# EAGLE design NixieClock Modified2  (EAGLE 7.5.0)
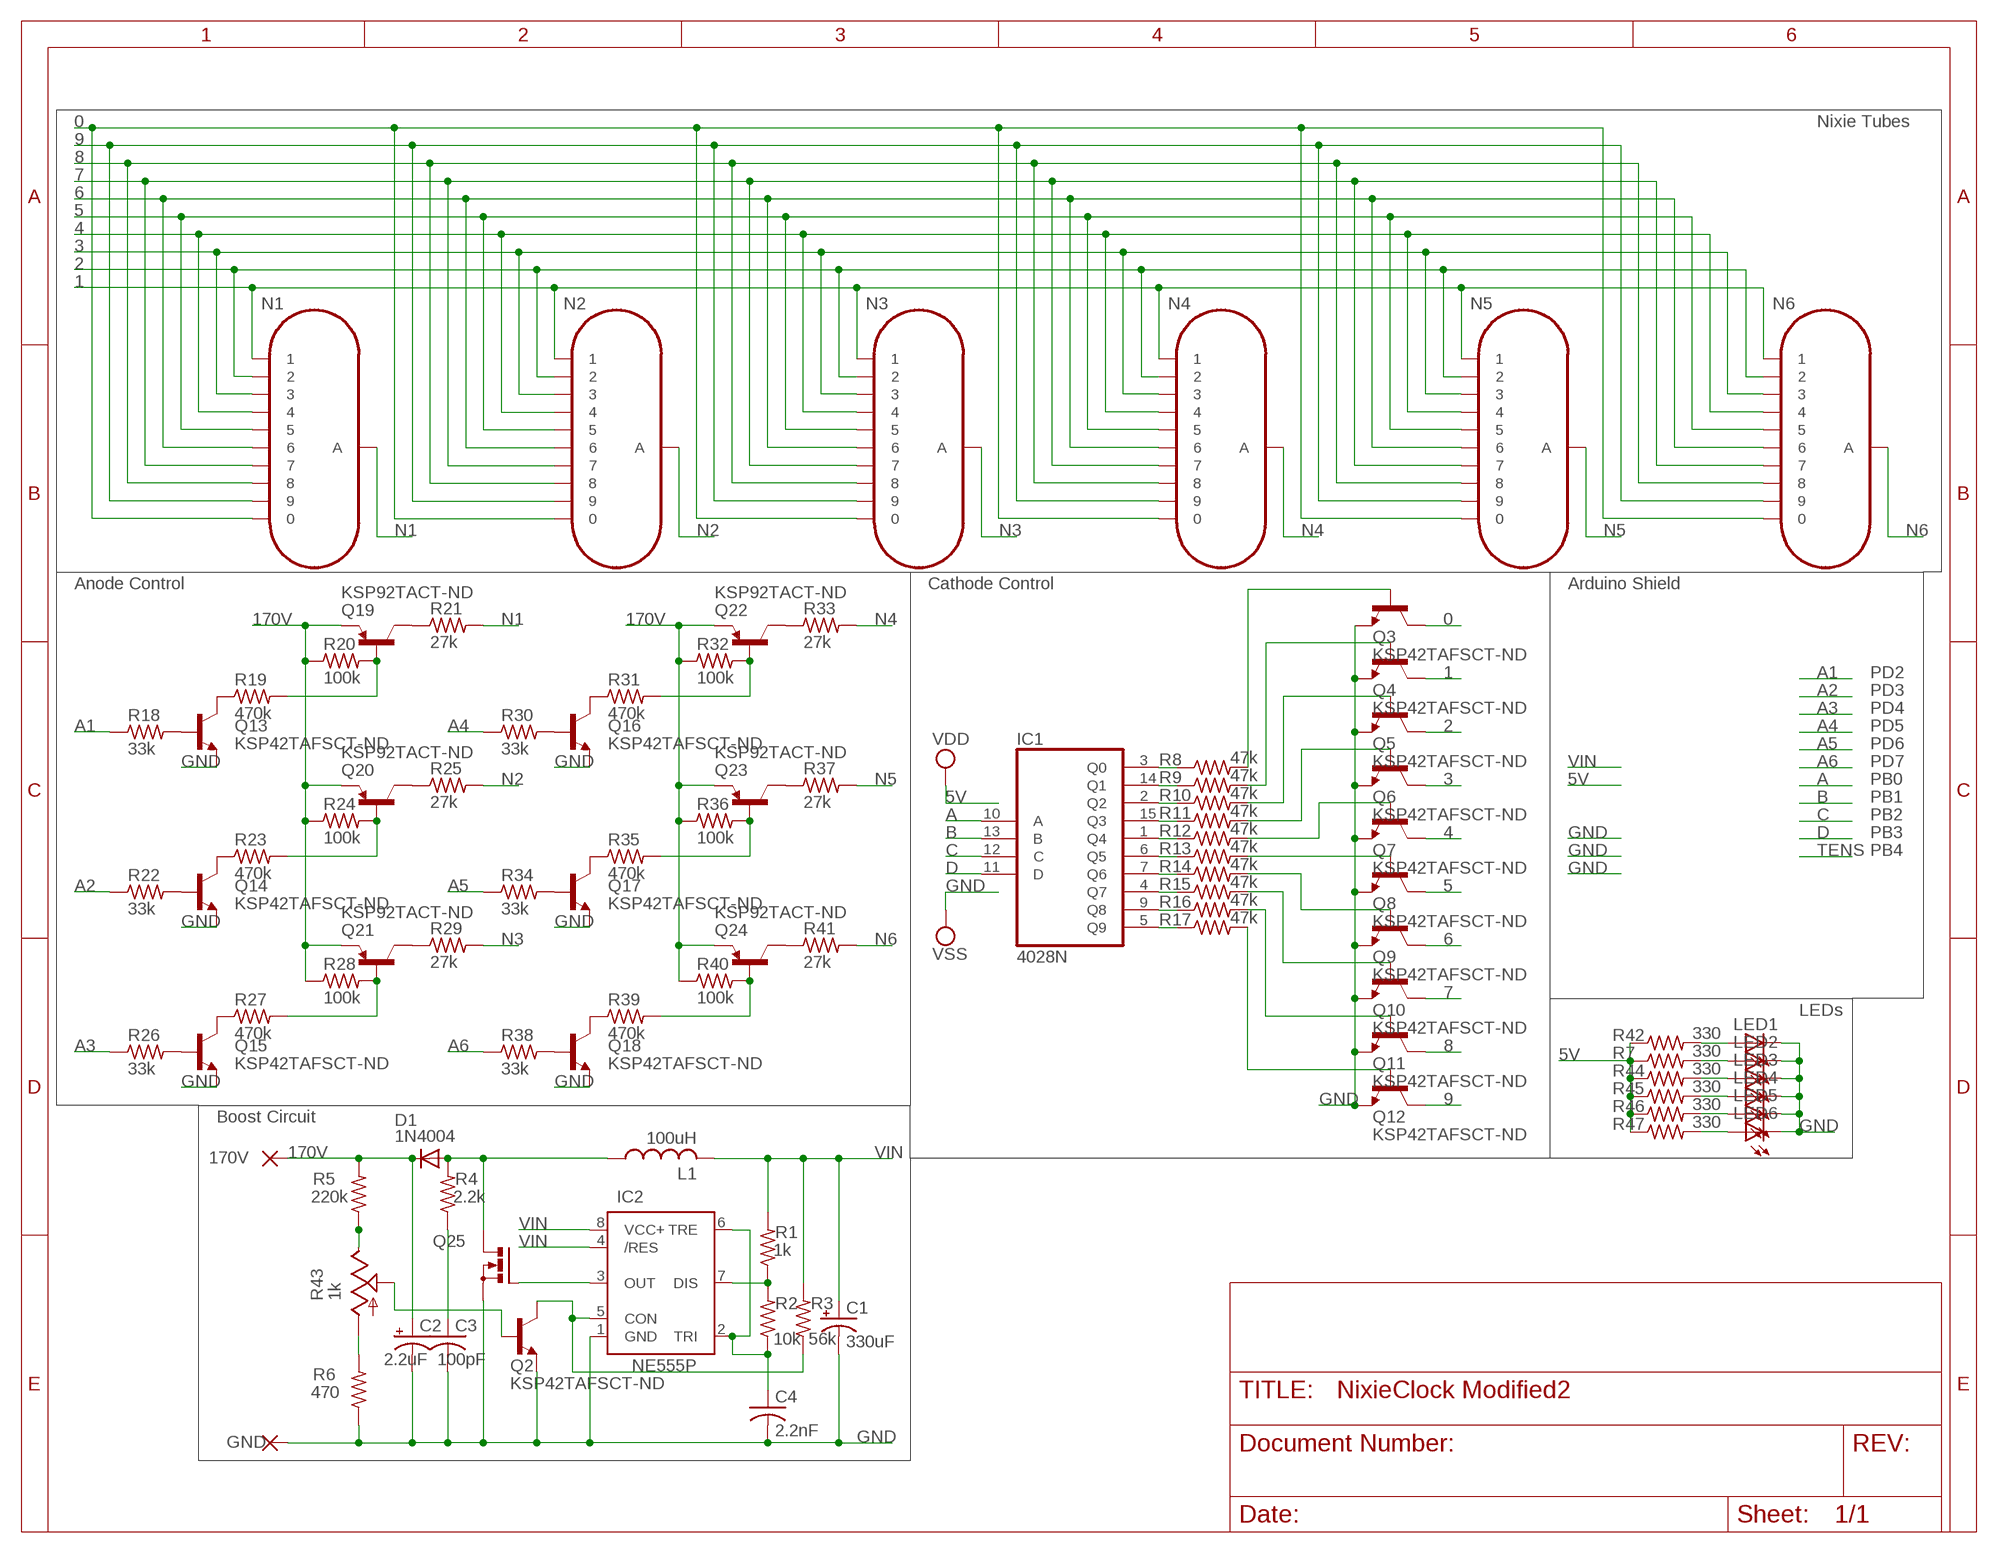
[diagram p0: schematic, sheet 1]

## Parts
C1  330uF  CPOL-USE2,5-6E  [E2,5-6E]
C2  2.2uF  CPOL-USE2,5-6E  [E2,5-6E]
C3  100pF  C-US050-025X075  [C050-025X075]
C4  2.2nF  C-US025-025X050  [C025-025X050]
D1  1N4004  [DO41-10]
IC1  4028N  [DIL16]
IC2  NE555P  [DIL-08]
L1  100uH  L-US6000-XXX-RC  [6000-XXXX-RC]
LED1  LEDCHIPLED_1206  [CHIPLED_1206]
LED2  LEDCHIPLED_1206  [CHIPLED_1206]
LED3  LEDCHIPLED_1206  [CHIPLED_1206]
LED4  LEDCHIPLED_1206  [CHIPLED_1206]
LED5  LEDCHIPLED_1206  [CHIPLED_1206]
LED6  LEDCHIPLED_1206  [CHIPLED_1206]
N1  IN-17  [IN-17]
N2  IN-17  [IN-17]
N3  IN-17  [IN-17]
N4  IN-17  [IN-17]
N5  IN-17  [IN-17]
N6  IN-17  [IN-17]
PAD13  GND  1,6/0,8  [1,6/0,8]
PAD14  170V  1,6/0,8  [1,6/0,8]
Q2  KSP42TAFSCT-ND  TRANSISTOR_NPNTO-92-AMMO  [TO-92-AMMO]
Q3  KSP42TAFSCT-ND  TRANSISTOR_NPNTO-92-AMMO  [TO-92-AMMO]
Q4  KSP42TAFSCT-ND  TRANSISTOR_NPNTO-92-AMMO  [TO-92-AMMO]
Q5  KSP42TAFSCT-ND  TRANSISTOR_NPNTO-92-AMMO  [TO-92-AMMO]
Q6  KSP42TAFSCT-ND  TRANSISTOR_NPNTO-92-AMMO  [TO-92-AMMO]
Q7  KSP42TAFSCT-ND  TRANSISTOR_NPNTO-92-AMMO  [TO-92-AMMO]
Q8  KSP42TAFSCT-ND  TRANSISTOR_NPNTO-92-AMMO  [TO-92-AMMO]
Q9  KSP42TAFSCT-ND  TRANSISTOR_NPNTO-92-AMMO  [TO-92-AMMO]
Q10  KSP42TAFSCT-ND  TRANSISTOR_NPNTO-92-AMMO  [TO-92-AMMO]
Q11  KSP42TAFSCT-ND  TRANSISTOR_NPNTO-92-AMMO  [TO-92-AMMO]
Q12  KSP42TAFSCT-ND  TRANSISTOR_NPNTO-92-AMMO  [TO-92-AMMO]
Q13  KSP42TAFSCT-ND  TRANSISTOR_NPNTO-92-AMMO  [TO-92-AMMO]
Q14  KSP42TAFSCT-ND  TRANSISTOR_NPNTO-92-AMMO  [TO-92-AMMO]
Q15  KSP42TAFSCT-ND  TRANSISTOR_NPNTO-92-AMMO  [TO-92-AMMO]
Q16  KSP42TAFSCT-ND  TRANSISTOR_NPNTO-92-AMMO  [TO-92-AMMO]
Q17  KSP42TAFSCT-ND  TRANSISTOR_NPNTO-92-AMMO  [TO-92-AMMO]
Q18  KSP42TAFSCT-ND  TRANSISTOR_NPNTO-92-AMMO  [TO-92-AMMO]
Q19  KSP92TACT-ND  TRANSISTOR_PNP  [TO-92-AMMO]
Q20  KSP92TACT-ND  TRANSISTOR_PNP  [TO-92-AMMO]
Q21  KSP92TACT-ND  TRANSISTOR_PNP  [TO-92-AMMO]
Q22  KSP92TACT-ND  TRANSISTOR_PNP  [TO-92-AMMO]
Q23  KSP92TACT-ND  TRANSISTOR_PNP  [TO-92-AMMO]
Q24  KSP92TACT-ND  TRANSISTOR_PNP  [TO-92-AMMO]
Q25  PMOSFET_NTO220BH  [TO220BH]
R1  1k  R-US_0204/5  [0204/5]
R2  10k  R-US_0204/5  [0204/5]
R3  56k  R-US_0204/5  [0204/5]
R4  2.2k  R-US_0204/5  [0204/5]
R5  220k  R-US_0204/5  [0204/5]
R6  470  R-US_0204/5  [0204/5]
R7  330  R-US_0204/5  [0204/5]
R8  47k  R-US_0204/5  [0204/5]
R9  47k  R-US_0204/5  [0204/5]
R10  47k  R-US_0204/5  [0204/5]
R11  47k  R-US_0204/5  [0204/5]
R12  47k  R-US_0204/5  [0204/5]
R13  47k  R-US_0204/5  [0204/5]
R14  47k  R-US_0204/5  [0204/5]
R15  47k  R-US_0204/5  [0204/5]
R16  47k  R-US_0204/5  [0204/5]
R17  47k  R-US_0204/5  [0204/5]
R18  33k  R-US_0204/5  [0204/5]
R19  470k  R-US_0204/5  [0204/5]
R20  100k  R-US_0204/5  [0204/5]
R21  27k  R-US_0204/5  [0204/5]
R22  33k  R-US_0204/5  [0204/5]
R23  470k  R-US_0204/5  [0204/5]
R24  100k  R-US_0204/5  [0204/5]
R25  27k  R-US_0204/5  [0204/5]
R26  33k  R-US_0204/5  [0204/5]
R27  470k  R-US_0204/5  [0204/5]
R28  100k  R-US_0204/5  [0204/5]
R29  27k  R-US_0204/5  [0204/5]
R30  33k  R-US_0204/5  [0204/5]
R31  470k  R-US_0204/5  [0204/5]
R32  100k  R-US_0204/5  [0204/5]
R33  27k  R-US_0204/5  [0204/5]
R34  33k  R-US_0204/5  [0204/5]
R35  470k  R-US_0204/5  [0204/5]
R36  100k  R-US_0204/5  [0204/5]
R37  27k  R-US_0204/5  [0204/5]
R38  33k  R-US_0204/5  [0204/5]
R39  470k  R-US_0204/5  [0204/5]
R40  100k  R-US_0204/5  [0204/5]
R41  27k  R-US_0204/5  [0204/5]
R42  330  R-US_0204/5  [0204/5]
R43  1k  TRIM_US-B64Y  [B64Y]
R44  330  R-US_0204/5  [0204/5]
R45  330  R-US_0204/5  [0204/5]
R46  330  R-US_0204/5  [0204/5]
R47  330  R-US_0204/5  [0204/5]

## Nets
0: N1.0 N2.0 N3.0 N4.0 N5.0 N6.0 Q3.3(C)
1: N1.1 N2.1 N3.1 N4.1 N5.1 N6.1 Q4.3(C)
2: N1.2 N2.2 N3.2 N4.2 N5.2 N6.2 Q5.3(C)
3: N1.3 N2.3 N3.3 N4.3 N5.3 N6.3 Q6.3(C)
4: N1.4 N2.4 N3.4 N4.4 N5.4 N6.4 Q7.3(C)
5: N1.5 N2.5 N3.5 N4.5 N5.5 N6.5 Q8.3(C)
5V: R7.1 R42.1 R44.1 R45.1 R46.1 R47.1 ; supply symbol labelled VDD
6: N1.6 N2.6 N3.6 N4.6 N5.6 N6.6 Q9.3(C)
7: N1.7 N2.7 N3.7 N4.7 N5.7 N6.7 Q10.3(C)
8: N1.8 N2.8 N3.8 N4.8 N5.8 N6.8 Q11.3(C)
9: N1.9 N2.9 N3.9 N4.9 N5.9 N6.9 Q12.3(C)
170V: C2.+ D1.C PAD14.1(P) Q19.1(E) Q20.1(E) Q21.1(E) Q22.1(E) Q23.1(E) Q24.1(E) R5.2 R20.1 R24.1 R28.1 R32.1 R36.1 R40.1
A: IC1.10(A)
A1: R18.1
A2: R22.1
A3: R26.1
A4: R30.1
A5: R34.1
A6: R38.1
B: IC1.13(B)
C: IC1.12(C)
D: IC1.11(D)
GND: C1.- C2.- C3.2 C4.2 IC2.1(GND) LED1.C LED2.C LED3.C LED4.C LED5.C LED6.C PAD13.1(P) Q2.1(E) Q3.1(E) Q4.1(E) Q5.1(E) Q6.1(E) Q7.1(E) Q8.1(E) Q9.1(E) Q10.1(E) Q11.1(E) Q12.1(E) Q13.1(E) Q14.1(E) Q15.1(E) Q16.1(E) Q17.1(E) Q18.1(E) Q25.S R6.1 ; supply symbol labelled VSS
N1: N1.A R21.2
N2: N2.A R25.2
N3: N3.A R29.2
N4: N4.A R33.2
N5: N5.A R37.2
N6: N6.A R41.2
N$1: IC2.3(OUT) Q25.G
N$2: IC2.7(DIS) R1.1 R2.2
N$3: C4.1 IC2.2(TRI) IC2.6(TRE) R2.1
N$4: IC2.5(CON) Q2.3(C) R3.1
N$5: C3.1 R4.1
N$6: D1.A L1.1 Q25.D R4.2
N$7: Q13.2(B) R18.2
N$8: R6.2 R43.A
N$9: R5.1 R43.E
N$10: Q2.2(B) R43.S
N$11: IC1.3(Q0) R8.1
N$12: IC1.14(Q1) R9.1
N$13: IC1.2(Q2) R10.1
N$14: IC1.15(Q3) R11.1
N$15: IC1.1(Q4) R12.1
N$16: IC1.6(Q5) R13.1
N$17: IC1.7(Q6) R14.1
N$18: IC1.4(Q7) R15.1
N$19: IC1.9(Q8) R16.1
N$20: Q13.3(C) R19.1
N$21: IC1.5(Q9) R17.1
N$22: Q3.2(B) R8.2
N$23: Q4.2(B) R9.2
N$24: Q5.2(B) R10.2
N$25: Q6.2(B) R11.2
N$26: Q12.2(B) R17.2
N$27: Q19.3(C) R21.1
N$28: Q19.2(B) R19.2 R20.2
N$29: Q10.2(B) R15.2
N$30: Q9.2(B) R14.2
N$31: Q8.2(B) R13.2
N$32: Q14.2(B) R22.2
N$33: Q14.3(C) R23.1
N$34: Q20.3(C) R25.1
N$35: Q20.2(B) R23.2 R24.2
N$36: Q15.2(B) R26.2
N$37: Q15.3(C) R27.1
N$38: Q21.3(C) R29.1
N$39: Q21.2(B) R27.2 R28.2
N$40: Q16.2(B) R30.2
N$41: Q16.3(C) R31.1
N$42: Q22.3(C) R33.1
N$43: Q22.2(B) R31.2 R32.2
N$44: Q17.2(B) R34.2
N$45: Q17.3(C) R35.1
N$46: Q23.3(C) R37.1
N$47: Q23.2(B) R35.2 R36.2
N$48: Q18.2(B) R38.2
N$49: Q18.3(C) R39.1
N$50: Q24.3(C) R41.1
N$51: Q24.2(B) R39.2 R40.2
N$52: LED1.A R42.2
N$53: LED2.A R7.2
N$54: LED3.A R44.2
N$55: Q11.2(B) R16.2
N$56: Q7.2(B) R12.2
N$57: LED4.A R45.2
N$58: LED5.A R46.2
N$59: LED6.A R47.2
VIN: C1.+ IC2.4(/RES) IC2.8(VCC+) L1.2 R1.2 R3.2

## Notes on the sheet
- Nixie Tubes
- Anode Control | Cathode Control | Arduino Shield
- PD2
- PD3
- PD4
- PD5
- PD6
- PD7
- PB0
- PB1
- PB2
- PB3
- PB4
- LEDs
- Boost Circuit

## Power pins joined to a net without a drawn wire
5V: IC1.16(VDD)
GND: IC1.8(VSS)

## Library data of the parts
C1 C2 = resistor:CPOL-US: POLARIZED CAPACITOR, American symbol
C3 = rcl:C-US: CAPACITOR, American symbol
C4 = resistor:C-US: CAPACITOR, American symbol
D1 = diode:1N4004: DIODE general purpose rectifier, 1 A
IC1 = 40xx:4028: BCD to decimal DECODER
IC2 = SparkFun-AnalogIC:NE555: General purpose bipolar Timer; MF: Arrow Electronics; MPN: NE555N; OC_FARNELL: 1467742; OC_NEWARK: 89K1486
L1 = rcl:L-US: INDUCTOR, American symbol
LED1-LED6 = led:LED: LED OSRAM: - CHIPLED LG R971, LG N971, LY N971, LG Q971, LY Q971, LO R971, LY R971 LH N974, LH R974 LS Q976, LO Q976, LY Q976 LO Q996 - Hyper CHIPLED LW Q18S LB Q993, LB Q99A, LB R99A - SideLED LS A670, LO A670, LY A670, LG A670, LP A670 LB A673, LV A673, LT A673, LW A673 LH A674 LY A675 LS A676, LA A676, LO A676, LY A676, LW A676 LS A679, LY A679, LG A679 - Hyper Micro SIDELED® LS Y876, LA Y876, LO Y876, LY Y876 LT Y87S - SmartLED LW L88C, LW L88S LB L89C, LB L89S, LG L890 LS L89K, LO L89K, LY L89K LS L896, LA L896, LO L896, LY L896 - TOPLED LS T670, LO T670, LY T670, LG T670, LP T670 LSG T670, LSP T670, LSY T670, LOP T670, LYG T670 LG T671, LOG T671, LSG T671 LB T673, LV T673, LT T673, LW T673 LH T674 LS T676, LA T676, LO T676, LY T676, LB T676, LH T676, LSB T676, LW T676 LB T67C, LV T67C, LT T67C, LS T67K, LO T67K, LY T67K, LW E67C LS E67B, LA E67B, LO E67B, LY E67B, LB E67C, LV E67C, LT E67C LW T67C LS T679, LY T679, LG T679 LS T770, LO T770, LY T770, LG T770, LP T770 LB T773, LV T773, LT T773, LW T773 LH T774 LS E675, LA E675, LY E675, LS T675 LS T776, LA T776, LO T776, LY T776, LB T776 LHGB T686 LT T68C, LB T68C - Hyper Mini TOPLED® LB M676 - Mini TOPLED Santana® LG M470 LS M47K, LO M47K, LY M47K Source: http://www.osram.convergy.de LUXEON: - LUMILED® LXK2-PW12-R00, LXK2-PW12-S00, LXK2-PW14-U00, LXK2-PW14-V00 LXK2-PM12-R00, LXK2-PM12-S00, LXK2-PM14-U00 LXK2-PE12-Q00, LXK2-PE12-R00, LXK2-PE12-S00, LXK2-PE14-T00, LXK2-PE14-U00 LXK2-PB12-K00, LXK2-PB12-L00, LXK2-PB12-M00, LXK2-PB14-N00, LXK2-PB14-P00, LXK2-PB14-Q00 LXK2-PR12-L00, LXK2-PR12-M00, LXK2-PR14-Q00, LXK2-PR14-R00 LXK2-PD12-Q00, LXK2-PD12-R00, LXK2-PD12-S00 LXK2-PH12-R00, LXK2-PH12-S00 LXK2-PL12-P00, LXK2-PL12-Q00, LXK2-PL12-R00 Source: www.luxeon.com KINGBRIGHT: KA-3528ASYC Source: www.kingbright.com
N1-N6 = russian-nixies:IN-17: IN-17: tiny numeric topview nixie tube
PAD13 PAD14 = wirepad:1,6/0,8: THROUGH-HOLE PAD
Q2-Q18 = SparkFun-DiscreteSemi:TRANSISTOR_NPN: Generic NPN BJT. MMBT2222 is the common NPN we use. Double check against datasheet- not all devices are the same!
Q19-Q24 = SparkFun-DiscreteSemi_tyler:TRANSISTOR_PNP: Generic PNP BJT. Double check pinouts against datasheets- not all devices are the same!
Q25 = transistor-power:PMOSFET_N: Power MOSFET N-Channel
R1-R42 R44-R47 = resistor:R-US_: RESISTOR, American symbol
R43 = pot:TRIM_US-: POTENTIOMETER

## Board
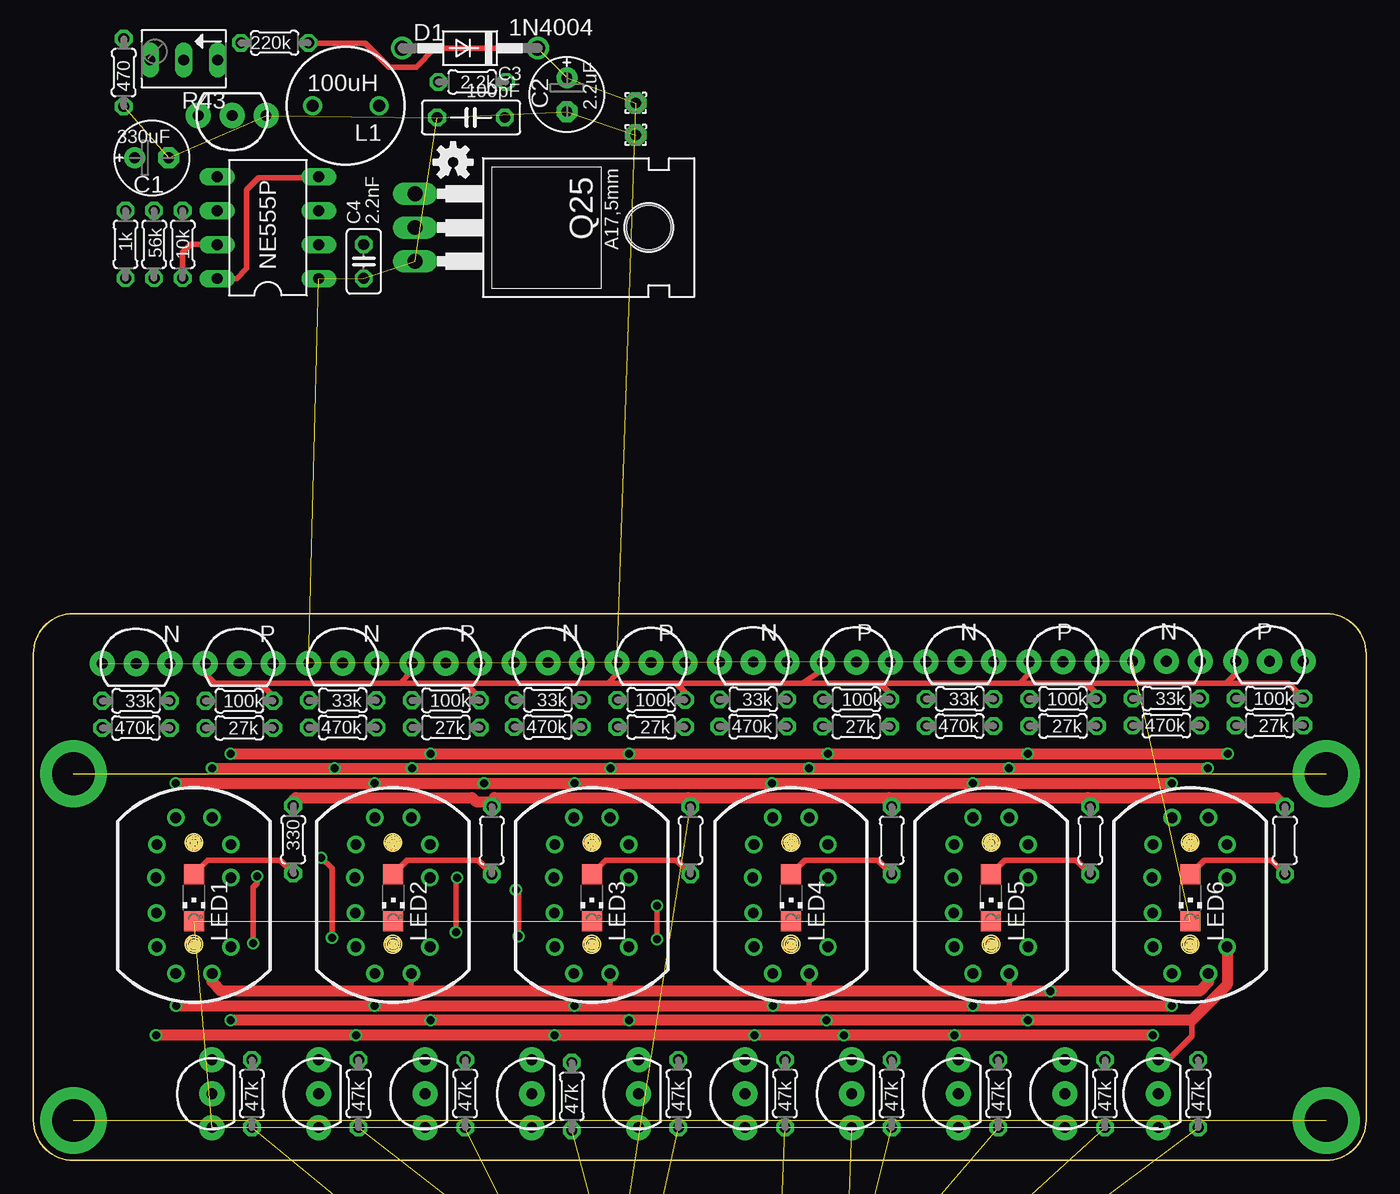
[diagram p1: board, top side]
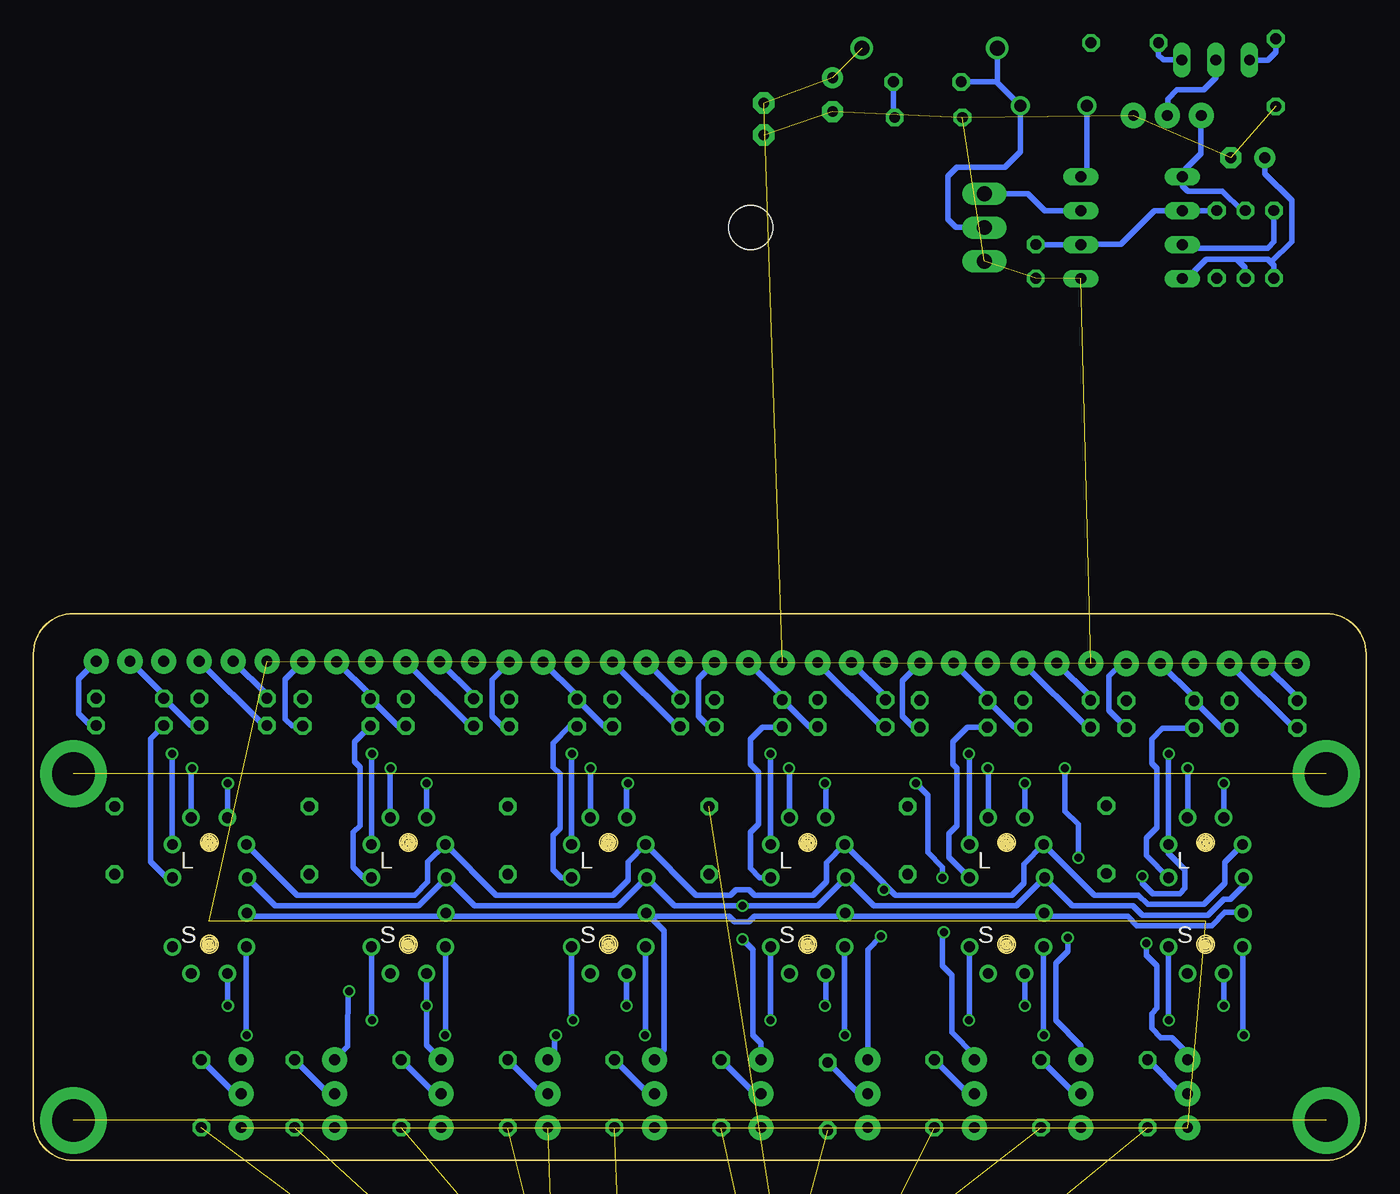
[diagram p2: board, bottom side, seen from below]

Size 100 x 41 mm. Coordinates in mm from the lower left corner, seen from the top.
Outline: 3,0 97,0 arc90 100,3 100,38 arc90 97,41 3,41 arc90 0,38 0,3 arc90 3,0
Copper layers (1*16): Top 0.035mm / dielectric 1.5mm / Bottom 0.035mm
Design rules "dirt_cheap_dirty_boards.v1 *": minimum track width 5mil, minimum drill 12mil, track to track 8mil, track to pad 8mil, pad to pad 8mil, via to via 8mil, smd to smd 0mil, copper to edge 10mil, drill to drill 10mil, minimum pad ring 10mil, minimum via ring 6mil, stop-mask expansion 2mil, vias tented up to drill 25mil, thermal gap 10mil
tRestrict: area 67.2,22.1 to 74.7,25.7
bRestrict: area 67.2,22.1 to 74.7,25.7

### Footprints (pad centres in the part's own frame; a part is rotated, then mirrored left to right if it is on the bottom)
E2,5-6E = drill 0.813 pad 1.575: + -1.27,0 | drill 0.813 pad 1.575 octagon: - 1.27,0
C050-025X075 = drill 0.813 octagon: 1 -2.54,0; 2 2.54,0
C025-025X050 = drill 0.813 octagon: 1 -1.27,0; 2 1.27,0
DO41-10 = drill 1.118: A 5.08,0; C -5.08,0
DIL16 = drill 0.813 long: 1 -8.89,-3.81; 2 -6.35,-3.81; 3 -3.81,-3.81; 4 -1.27,-3.81; 5 1.27,-3.81; 6 3.81,-3.81; 7 6.35,-3.81; 8 8.89,-3.81; 9 8.89,3.81; 10 6.35,3.81; 11 3.81,3.81; 12 1.27,3.81; 13 -1.27,3.81; 14 -3.81,3.81; 15 -6.35,3.81; 16 -8.89,3.81
DIL-08 = drill 0.813 long: 1 -3.81,-3.81; 2 -1.27,-3.81; 3 1.27,-3.81; 4 3.81,-3.81; 5 3.81,3.81; 6 1.27,3.81; 7 -1.27,3.81; 8 -3.81,3.81
6000-XXXX-RC = drill 0.9 pad 1.422: 1 -2.5,0; 2 2.5,0
CHIPLED_1206 = smd 1.5 x 1.5: A 0,-1.75; C 0,1.75
IN-17 = drill 0.8: 0 2.777,4; 1 1.365,6; 2 -1.365,6; 3 -2.778,4; 4 -2.858,1.5; 5 -2.818,-1.143; 6 -2.778,-3.683; 7 -1.365,-5.683; 8 1.365,-5.683; 9 2.777,-3.683; A 2.777,1.5
1,6/0,8 = drill 0.813 pad 1.6 octagon: 1 0,0
TO-92-AMMO = drill 0.813 pad 1.88: 1 -2.54,0; 2 0,0; 3 2.54,0
TO220BH = drill 1.118 long: D 0,-6.35; G -2.54,-6.35; S 2.54,-6.35 | hole 3.302: 0,11.176
0204/5 = drill 0.813 octagon: 1 -2.54,0; 2 2.54,0
B64Y = drill 0.813 long: A 2.54,0; E -2.54,0; S 0,0

### Placement (x,y rotation side)
C1  8.88,75.19 0 top  (outside the outline)
C2  40.03,79.93 270 top  (outside the outline)
C3  32.84,78.21 180 top  (outside the outline)
C4  24.79,67.42 270 top  (outside the outline)
D1  32.76,83.42 180 top  (outside the outline)
IC1  51.58,-19.52 0 top  (outside the outline)
IC2  17.6,69.95 90 top  (outside the outline)
L1  23.44,79.09 180 top  (outside the outline)
LED1  12.05,19.7 180 top
LED2  27,19.7 180 top
LED3  41.9,19.7 180 top
LED4  56.85,19.7 180 top
LED5  71.85,19.7 180 top
LED6  86.8,19.7 180 top
N1  12.05,19.7 0 top
N2  26.99,19.7 0 top
N3  41.9,19.7 0 top
N4  56.84,19.7 0 top
N5  71.86,19.7 0 top
N6  86.8,19.7 0 top
PAD13  45.2,76.9 270 top  (outside the outline)
PAD14  45.2,79.3 270 top  (outside the outline)
Q2  14.91,78.36 180 top  (outside the outline)
Q3  13.4,5 90 top
Q4  21.4,5 90 top
Q5  29.4,5 90 top
Q6  37.4,5 90 top
Q7  45.4,5 90 top
Q8  53.4,5 90 top
Q9  61.4,5 90 top
Q10  69.4,5 90 top
Q11  77.4,5 90 top
Q12  84.4,5 90 top
Q13  7.71,37.26 0 top
Q14  23.21,37.3 0 top
Q15  38.61,37.34 0 top
Q16  54.01,37.37 0 top
Q17  69.51,37.41 0 top
Q18  85.01,37.44 0 top
Q19  15.45,37.26 0 top
Q20  30.95,37.3 0 top
Q21  46.35,37.34 0 top
Q22  61.75,37.37 0 top
Q23  77.25,37.41 0 top
Q24  92.75,37.44 0 top
Q25  35,69.96 270 top  (outside the outline)
R1  6.92,68.7 270 top  (outside the outline)
R2  11.21,68.7 270 top  (outside the outline)
R3  9.06,68.7 270 top  (outside the outline)
R4  32.93,80.89 180 top  (outside the outline)
R5  18.11,83.82 0 top  (outside the outline)
R6  6.78,81.58 90 top  (outside the outline)
R7  34.4,24 270 top
R8  16.4,5 90 top
R9  24.4,5 90 top
R10  32.4,5 90 top
R11  40.4,4.8 90 top
R12  48.4,5 90 top
R13  56.4,5 90 top
R14  64.4,5 90 top
R15  72.4,5 90 top
R16  80.4,5 90 top
R17  87.4,5 90 top
R18  7.71,34.47 180 top
R19  7.71,32.44 0 top
R20  15.45,34.47 180 top
R21  15.45,32.44 180 top
R22  23.21,34.51 180 top
R23  23.21,32.47 0 top
R24  30.95,34.51 180 top
R25  30.95,32.47 180 top
R26  38.61,34.54 180 top
R27  38.61,32.51 0 top
R28  46.35,34.54 180 top
R29  46.35,32.51 180 top
R30  54.01,34.58 180 top
R31  54.01,32.55 0 top
R32  61.75,34.58 180 top
R33  61.75,32.55 180 top
R34  69.51,34.61 180 top
R35  69.51,32.58 0 top
R36  77.25,34.61 180 top
R37  77.25,32.58 180 top
R38  85.01,34.65 180 top
R39  85.01,32.62 0 top
R40  92.75,34.65 180 top
R41  92.75,32.62 180 top
R42  19.49,24.06 270 top
R43  11.29,82.53 180 top  (outside the outline)
R44  49.3,24 270 top
R45  64.4,24 270 top
R46  79.3,24 270 top
R47  93.9,24 270 top
U$7  [OSHW-LOGO-S]  31.5,74.87 0 top  (outside the outline)

### Tracks (layer width: path | path; a pad name or v marks a point on that pad's centre or on a via)
0  (via drill 0.6)
  Top 0.406: v16.5,16.3 16.5,20.5 16.8,20.8 v16.8,21.3
  Top 0.813: v14.8,30.5 v29.8,30.5 v44.7,30.5 v59.6,30.5 v74.6,30.5 v89.6,30.5
  Bottom 0.406: v14.8,30.5 14.83,30.37 N1.0 14.83,23.03 13.6,21.8 13.6,20.4 14,20 16,20 16.8,20.8 v16.8,21.3 | N5.0 74.64,30.46 v74.6,30.5 | N4.0 59.62,30.48 v59.6,30.5 | N3.0 44.68,30.48 v44.7,30.5 | N2.0 29.77,30.46 v29.8,30.5 | 89.6,23.73 89.6,23.8 | 89.6,23.8 v89.6,30.5 | N6.0 89.57,23.77 89.6,23.8 | Q3.3 13.4,8 14.6,9.2 15.4,9.2 16.1,9.9 16.1,11 15.7,11.4 15.7,14.6 16.5,15.4 v16.5,16.3
1  (via drill 0.6)
  Top 0.406: v22.4,16.7 22.4,21.9 v21.6,22.7
  Top 0.813: v13.4,29.4 v22.6,29.4 v28.4,29.4 v43.3,29.4 v58.2,29.4 v73.2,29.4 v88.1,29.4
  Bottom 0.406: N5.1 73.22,29.38 v73.2,29.4 | N4.1 v58.21,29.39 v58.2,29.4 | N3.1 43.27,29.37 v43.3,29.4 | N2.1 28.35,29.35 v28.4,29.4 | N6.1 88.16,29.34 v88.1,29.4 | Q4.3 21.4,8.6 23.3,10.5 23.3,14.8 22.4,15.7 v22.4,16.7 | v21.6,22.7 21.6,25.2 22.6,26.2 v22.6,29.4 | v13.4,29.4 13.4,25.71 N1.1
2  (via drill 0.6)
  Top 0.406: v10.69,28.29 10.7,28.3 | v31.7,17.1 31.7,21.1 v31.8,21.2
  Top 0.813: 10.7,28.3 v25.6,28.3 v33.8,28.3 v40.6,28.3 v55.4,28.3 v70.5,28.3 v85.4,28.3
  Bottom 0.406: N1.2 v10.69,28.29 | v85.4,28.3 85.4,25.73 N6.2 | N5.2 v70.49,28.29 v70.5,28.3 | N4.2 55.48,28.22 v55.4,28.3 | N3.2 40.54,28.24 v40.6,28.3 | N2.2 25.62,28.28 v25.6,28.3 | Q5.3 29.4,7.9 31.1,9.6 31.1,13.9 31.8,14.6 31.8,17 v31.7,17.1 | v31.8,21.2 31.8,22 32.9,23.1 32.9,27.4 v33.8,28.3
3  (via drill 0.6)
  Top 0.406: v36.4,16.8 36.4,20.1 v36.2,20.3
  Bottom 0.406: 36.11,20.69 35.33,19.9 26.6,19.9 25.7,20.8 25.7,22.21 N2.3 20.41,19.9 17.1,19.9 16.4,19.2 12.2,19.2 10.6,20.8 10.6,22.37 N1.3 | 36.11,20.69 36.2,20.77 | 36.2,20.77 N3.3 40.5,22.33 40.5,20.9 41.5,19.9 45.9,19.9 46.3,20.3 47.3,20.3 47.7,19.9 50.26,19.9 N4.3 55.4,22.36 55.4,21 56.5,19.9 65.28,19.9 N5.3 70.4,22.38 70.4,20.9 71.4,19.9 80.22,19.9 N6.3 | 36.11,20.69 36.2,20.6 v36.2,20.3 36.2,20.77 | Q6.3 37.4,15.8 v36.4,16.8
4  (via drill 0.6)
  Top 0.406: v46.8,16.6 v46.8,19.1
  Bottom 0.406: N6.4 81.84,19.1 71.1,19.1 N5.4 66.9,19.1 56.09,19.1 N4.4 51.88,19.1 v46.8,19.1 41.15,19.1 N3.4 36.95,19.1 26.23,19.1 N2.4 22.03,19.1 17.5,19.1 16.8,18.4 11.9,18.4 10.7,19.6 10.2,19.6 9.19,20.61 N1.4 | Q7.3 45.4,8.8 46,9.4 46,15.8 v46.8,16.6
5
  Bottom 0.406: N6.5 83.72,18.3 69.3,18.3 N5.5 68.78,18.3 54.28,18.3 N4.5 | N4.5 53.77,18.3 47.8,18.3 47.4,17.9 46.3,17.9 45.9,18.3 39.34,18.3 N3.5 38.83,18.3 24.43,18.3 N2.5 23.91,18.3 17.9,18.3 17.2,17.6 11.6,17.6 10.6,18.6 9.29,18.6 N1.5 | Q8.3 53.4,7.6 52.7,8.3 52.7,17.23 N4.5
5V  (1 unrouted)
  Top 0.406: 34.3,26.9 34.6,27.2 | 79.3,27 79.1,27.2 | 64.4,27 64.2,27.2 | 49.3,27 49.1,27.2
  Top 0.813: 34.3,26.9 33.2,26.9 32.9,27.2 19.7,27.2 19.49,26.99 R42.1 | R47.1 93.24,27.2 79.1,27.2 64.2,27.2 49.1,27.2 34.6,27.2 34.4,26.9 R7.1 | R46.1 79.3,27 | R45.1 64.4,27 | R44.1 49.3,27
6  (via drill 0.6)
  Top 0.813: v84,9.4 v69.1,9.4 v60.8,9.4 v54.1,9.4 v39.1,9.4 v24.2,9.4 v9.2,9.4
  Bottom 0.406: N6.6 84.02,9.42 v84,9.4 | N1.6 9.27,9.47 v9.2,9.4 | N2.6 v24.21,9.41 v24.2,9.4 | N3.6 39.13,9.43 v39.1,9.4 | N4.6 54.06,9.44 v54.1,9.4 | N5.6 69.08,9.42 v69.1,9.4 | v60.8,9.4 60.9,9.4 60.9,8.04 Q9.3
7  (via drill 0.6)
  Top 0.813: v10.7,11.6 v25.6,11.6 v40.6,11.6 v55.5,11.6 v70.5,11.6 v85.4,11.6
  Bottom 0.406: N1.7 10.69,11.62 v10.7,11.6 | v85.4,11.6 85.4,13.99 N6.7 | N5.7 v70.49,11.61 v70.5,11.6 70.5,8.64 Q10.3 | N4.7 55.48,11.62 v55.5,11.6 | N3.7 40.54,11.66 v40.6,11.6 | N2.7 25.62,11.62 v25.6,11.6
8  (via drill 0.6)
  Top 0.406: N2.8 28.35,12.75 28.4,12.7 | N3.8 43.27,12.77 43.2,12.7 | N4.8 58.21,12.71 58.2,12.7 | N5.8 73.22,12.78 73.3,12.7
  Top 0.813: N6.8 88.16,13.36 87.5,12.7 v76.3,12.7 73.3,12.7 58.2,12.7 43.2,12.7 28.4,12.7 14.1,12.7 13.41,13.41 N1.8
  Bottom 0.406: v76.3,12.7 76.39,12.61 76.4,9.3 76.4,8.54 Q11.3
9  (via drill 0.6)
  Top 0.406: 86.9,10.5 86.9,9.3 85.2,7.6 84.46,7.6 Q12.3
  Top 0.813: v14.8,10.5 v29.8,10.5 v44.7,10.5 v59.5,10.5 v74.6,10.5 86.9,10.5 89.57,13.17 N6.9
  Bottom 0.406: N1.9 14.83,10.53 v14.8,10.5 | N2.9 29.77,10.54 v29.8,10.5 | N3.9 44.68,10.52 v44.7,10.5 | N4.9 59.62,10.62 v59.5,10.5 | N5.9 74.64,10.54 v74.6,10.5
170V  (3 unrouted)
  Top 0.406: D1.C 30.12,83.42 28.7,82 26.7,82 24.9,83.8 20.66,83.8 R5.2 | Q19.1 12.91,36.49 13.6,35.8 17,35.8 | 17,35.8 27.5,35.8 | 27.5,35.8 32.4,35.8 | 32.4,35.8 43.1,35.8 | 43.1,35.8 48.2,35.8 | 48.2,35.8 57.7,35.8 | 57.7,35.8 63.5,35.8 | 63.5,35.8 74,35.8 | 74,35.8 79,35.8 | 79,35.8 89.5,35.8 | 89.5,35.8 94.14,35.8 R40.1 | Q24.1 90.21,36.51 89.5,35.8 | R36.1 79.79,35.01 79,35.8 | Q23.1 74.71,36.51 74,35.8 | R32.1 64.29,35.01 63.5,35.8 | Q22.1 59.21,36.81 57.7,35.8 | R28.1 48.89,35.11 48.2,35.8 | Q21.1 43.81,36.51 43.1,35.8 | R24.1 33.49,34.71 32.4,35.8 | Q20.1 28.41,36.71 27.5,35.8 | R20.1 17.99,34.81 17,35.8
GND  (31 unrouted)
N1
  Bottom 0.406: R21.2 12.95,32.4 15.3,32.4 16.1,31.6 16.1,29.8 15.7,29.4 15.7,24.95 16.5,24.15 16.5,22.87 N1.A
N2
  Bottom 0.406: R25.2 29.93,32.47 31,31.4 31,29.7 30.7,29.4 30.7,25.1 31.3,24.5 31.3,22.73 N2.A
N3
  Bottom 0.406: N3.A 45.5,21.2 46.2,21.9 46.2,24.6 45.6,25.2 45.6,29.1 46.2,29.7 46.2,31.6 45.3,32.5 R29.2
N4
  Bottom 0.406: N4.A 60.4,21.2 61,21.8 61,24.4 60.5,24.9 60.5,29 61,29.5 61,31.3 59.75,32.55 R33.2
N5
  Bottom 0.406: N5.A 75.2,21.2 76,22 76,24.6 75.5,25.1 75.5,29.5 75.9,29.9 75.9,31.39 R37.2
N6
  Bottom 0.406: N6.A 90,21.2 91.2,22.4 91.2,31.63 R41.2
N$1
  Bottom 0.406: Q25.G 25.4,72.5 24.12,71.22 IC2.3
N$2
  Top 0.406: R2.2 11.21,68.11 11.8,68.7 13.77,68.7 IC2.7
  Bottom 0.406: 13.81,68.7 IC2.7 13.51,68.4 7.4,68.4 6.92,68.88 R1.1
N$3
  Bottom 0.406: R2.1 11.23,71.22 IC2.6 15.88,71.22 18.4,68.7 21.39,68.7 IC2.2 24.77,68.68 C4.1
N$4
  Bottom 0.406: R3.1 9.34,71.24 10.8,72.7 13.4,72.7 13.8,73.1 13.8,73.75 | 13.8,73.75 IC2.5 | 13.8,73.75 13.8,74.1 12.4,75.5 12.4,78.34 Q2.3
N$5
  Bottom 0.406: R4.1 35.47,78.3 C3.1
N$6
  Bottom 0.406: D1.A 27.68,80.82 | 27.68,80.82 L1.1 25.94,75.66 27.1,74.5 30.7,74.5 31.4,73.8 31.4,70.6 30.8,70 28.69,70 Q25.D | R4.2 27.74,80.89 27.68,80.82
N$7
  Bottom 0.406: R18.2 5.17,34.72 Q13.2
N$8
  Bottom 0.406: R6.2 6.78,83.12 7.4,82.5 8.72,82.5 R43.A
N$9
  Bottom 0.406: R43.E 15.23,82.53 15.6,82.9 15.6,83.78 R5.1
N$10
  Bottom 0.406: R43.S 11.29,81.21 12.2,80.3 14.2,80.3 14.9,79.6 14.9,78.38 Q2.2
N$11  (1 unrouted)
N$12  (1 unrouted)
N$13  (1 unrouted)
N$14  (1 unrouted)
N$15  (1 unrouted)
N$16  (1 unrouted)
N$17  (1 unrouted)
N$18  (1 unrouted)
N$19  (1 unrouted)
N$20
  Bottom 0.406: R19.1 5.42,32.44 Q13.3
N$21  (1 unrouted)
N$22
  Bottom 0.406: Q3.2 13.86,5 R8.2
N$23
  Bottom 0.406: Q4.2 21.86,5 R9.2
N$24
  Bottom 0.406: Q5.2 29.86,5 R10.2
N$25
  Bottom 0.406: Q6.2 38.06,5 R11.2
N$26
  Bottom 0.406: Q12.2 84.86,5 R17.2
N$27
  Bottom 0.406: Q19.3 18.34,37.26 19.3,36.3 19.3,33.75 R21.1
N$28
  Bottom 0.406: Q19.2 12.91,34.72 R20.2 10.88,32.44 R19.2
N$29
  Bottom 0.406: Q10.2 69.86,5 R15.2
N$30
  Bottom 0.406: Q9.2 61.86,5 R14.2
N$31
  Bottom 0.406: Q8.2 53.86,5 R13.2
N$32
  Bottom 0.406: R22.2 20.67,34.76 Q14.2
N$33
  Bottom 0.406: R23.1 20.93,32.47 Q14.3
N$34
  Bottom 0.406: R25.1 33.97,32.47 34.8,33.3 34.8,35.99 Q20.3
N$35
  Bottom 0.406: Q20.2 28.41,34.76 R24.2 26.38,32.47 R23.2
N$36
  Bottom 0.406: R26.2 36.07,34.8 Q15.2
N$37
  Bottom 0.406: R27.1 36.33,32.51 Q15.3
N$38
  Bottom 0.406: R29.1 49.31,32.51 50.1,33.3 50.1,36.13 Q21.3
N$39
  Bottom 0.406: Q21.2 43.81,34.8 R28.2 41.78,32.51 R27.2
N$40
  Bottom 0.406: R30.2 51.47,34.83 Q16.2
N$41
  Bottom 0.406: R31.1 51.73,32.55 Q16.3
N$42
  Bottom 0.406: R33.1 64.85,32.55 65.6,33.3 65.6,36.06 Q22.3
N$43
  Bottom 0.406: Q22.2 59.21,34.83 R32.2 57.18,32.55 R31.2
N$44
  Bottom 0.406: R34.2 66.97,34.87 Q17.2
N$45
  Bottom 0.406: R35.1 67.22,32.58 Q17.3
N$46
  Bottom 0.406: R37.1 80.58,32.58 81.1,33.1 81.1,36.1 Q23.3
N$47
  Bottom 0.406: Q23.2 74.71,34.87 R36.2 72.68,32.58 R35.2
N$48
  Bottom 0.406: R38.2 82.47,34.9 Q18.2
N$49
  Bottom 0.406: R39.1 82.72,32.62 Q18.3
N$50
  Bottom 0.406: R41.1 95.72,32.62 96.6,33.5 96.6,36.13 Q24.3
N$51
  Bottom 0.406: Q24.2 90.21,34.9 R40.2 88.18,32.62 R39.2
N$52
  Top 0.406: R42.2 18.52,22.49 13.09,22.49 LED1.A
N$53
  Top 0.406: R7.2 33.37,22.49 28.04,22.49 LED2.A
N$54
  Top 0.406: R44.2 48.27,22.49 42.94,22.49 LED3.A
N$55
  Bottom 0.406: Q11.2 77.86,5 R16.2
N$56
  Bottom 0.406: Q7.2 45.86,5 R12.2
N$57
  Top 0.406: R45.2 63.37,22.49 57.89,22.49 LED4.A
N$58
  Top 0.406: R46.2 78.27,22.49 72.89,22.49 LED5.A
N$59
  Top 0.406: R47.2 92.87,22.49 87.84,22.49 LED6.A
N$60  (via drill 3.2 pad 5)  (1 unrouted)
  other vias: 3,3 97,3
N$61  (via drill 3.2 pad 5)  (1 unrouted)
  other vias: 3,29 97,29
VIN
  Top 0.406: IC2.8 15.24,66.14 16,66.9 16,72.8 16.9,73.7 21.35,73.7 IC2.4
  Bottom 0.406: IC2.8 13.46,66.14 12,67.6 9.7,67.6 | 9.7,67.6 9.1,67 9.1,66.2 R3.2 | R1.2 6.92,67.12 7.15,67.35 | 7.15,67.35 7.4,67.6 9.7,67.6 | C1.+ 7.61,74.01 5.6,72 5.6,68.9 7.15,67.35 | L1.2 20.94,74.23 IC2.4

### Text on the board
bPlace: L | L | L | L | L | L | S | S | S | S | S | S
tNames: N | P | N | P | N | P | N | P | N | P | N | P